# EAGLE schematic Leah board (EAGLE 7.1.0)
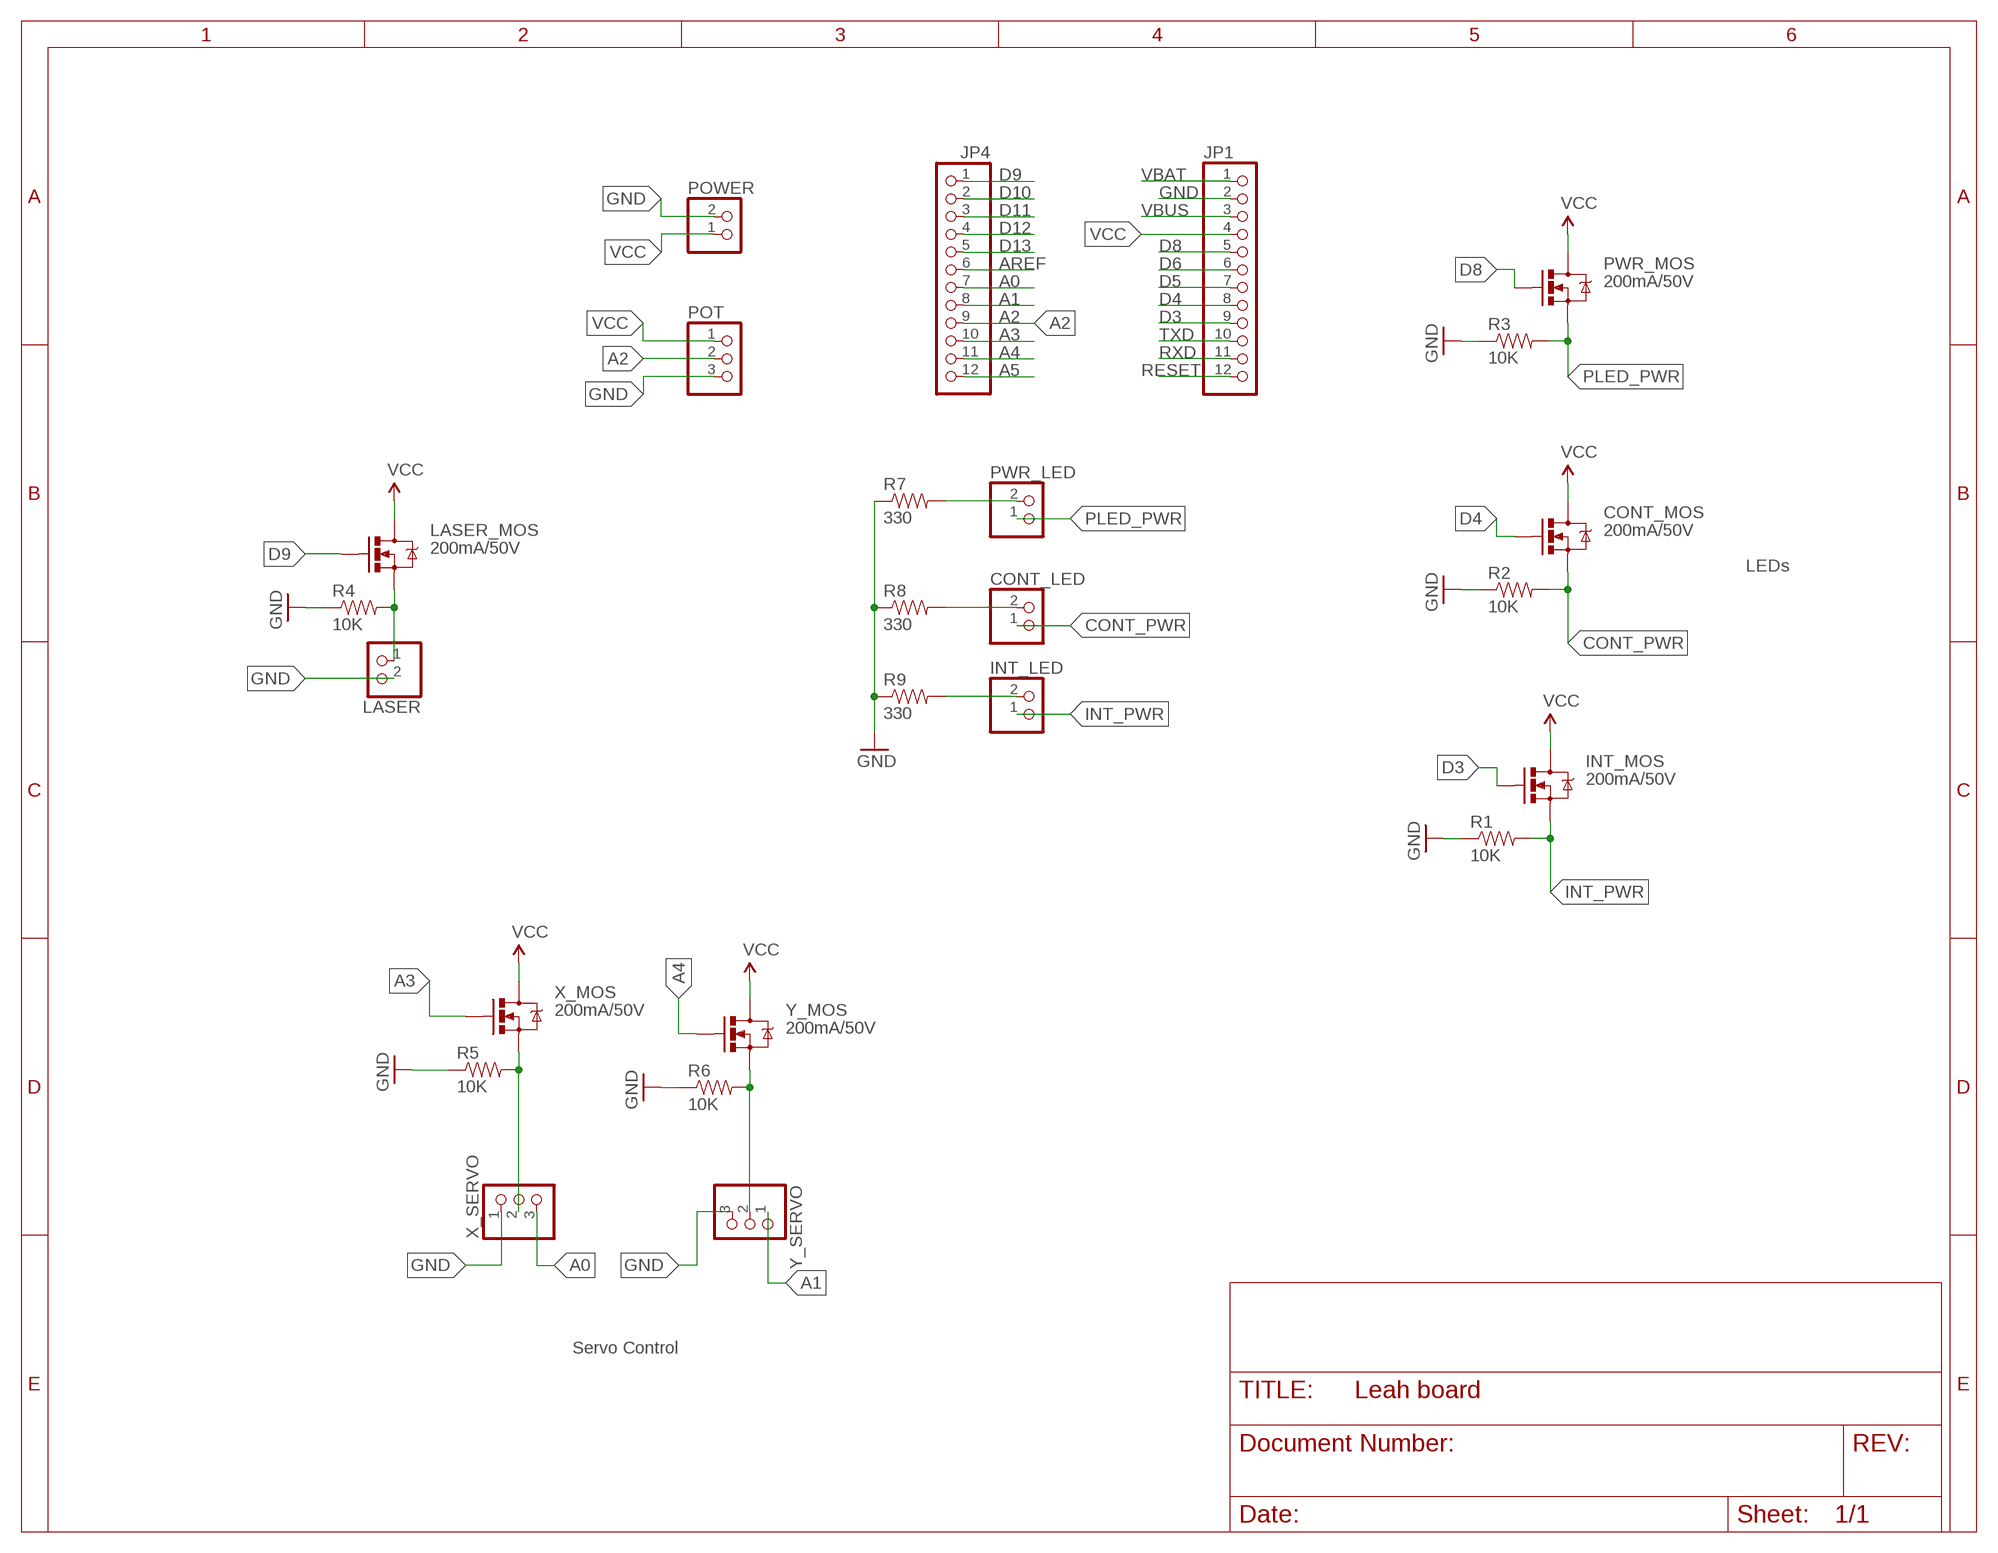
[diagram p0: schematic, sheet 1]

## Parts
CONT_LED  JST_2PIN-SMT-RA  [JST-PH-2-SMT-RA]
CONT_MOS  200mA/50V  MOSFET-NCHANNELBSS138  [SOT23-3]
INT_LED  JST_2PIN-SMT-RA  [JST-PH-2-SMT-RA]
INT_MOS  200mA/50V  MOSFET-NCHANNELBSS138  [SOT23-3]
JP1  PINHD-1X12-CB  [1X12-CB]
JP4  PINHD-1X12-CB  [1X12-CB]
LASER  JST_2PIN-SMT-RA  [JST-PH-2-SMT-RA]
LASER_MOS  200mA/50V  MOSFET-NCHANNELBSS138  [SOT23-3]
POT  JST_3PIN  [JSTPH3]
POWER  JST_2PIN-SMT-RA  [JST-PH-2-SMT-RA]
PWR_LED  JST_2PIN-SMT-RA  [JST-PH-2-SMT-RA]
PWR_MOS  200mA/50V  MOSFET-NCHANNELBSS138  [SOT23-3]
R1  10K  10KOHM-1/10W-1%(0603)0603  [0603-RES]
R2  10K  10KOHM-1/10W-1%(0603)0603  [0603-RES]
R3  10K  10KOHM-1/10W-1%(0603)0603  [0603-RES]
R4  10K  10KOHM-1/10W-1%(0603)0603  [0603-RES]
R5  10K  10KOHM-1/10W-1%(0603)0603  [0603-RES]
R6  10K  10KOHM-1/10W-1%(0603)0603  [0603-RES]
R7  330  3.3MOHM-1/10W-1%(0603)  [0603-RES]
R8  330  3.3MOHM-1/10W-1%(0603)  [0603-RES]
R9  330  3.3MOHM-1/10W-1%(0603)  [0603-RES]
X_MOS  200mA/50V  MOSFET-NCHANNELBSS138  [SOT23-3]
X_SERVO  PINHD-1X3  [1X03]
Y_MOS  200mA/50V  MOSFET-NCHANNELBSS138  [SOT23-3]
Y_SERVO  PINHD-1X3  [1X03]

## Nets
A0: JP4.7 X_SERVO.3
A1: JP4.8 Y_SERVO.1
A2: JP4.9 POT.2
A3: JP4.10 X_MOS.1(G)
A4: JP4.11 Y_MOS.1(G)
A5: JP4.12
AREF: JP4.6
CONT_PWR: CONT_LED.1 CONT_MOS.2(S) R2.2
D3: INT_MOS.1(G) JP1.9
D4: CONT_MOS.1(G) JP1.8
D5: JP1.7
D6: JP1.6
D8: JP1.5 PWR_MOS.1(G)
D9: JP4.1 LASER_MOS.1(G)
D10: JP4.2
D11: JP4.3
D12: JP4.4
D13: JP4.5
GND [power]: JP1.2 LASER.2 POT.3 POWER.2 R1.1 R2.1 R3.1 R4.1 R5.1 R6.1 R7.1 R8.1 R9.1 X_SERVO.1 Y_SERVO.3
INT_PWR: INT_LED.1 INT_MOS.2(S) R1.2
LASER_PWR: LASER.1 LASER_MOS.2(S) R4.2
N$6: R6.2 Y_MOS.2(S) Y_SERVO.2
N$7: R5.2 X_MOS.2(S) X_SERVO.2
N$8: PWR_LED.2 R7.2
N$9: CONT_LED.2 R8.2
N$10: INT_LED.2 R9.2
PLED_PWR: PWR_LED.1 PWR_MOS.2(S) R3.2
RESET: JP1.12
RXD: JP1.11
TXD: JP1.10
VBAT: JP1.1
VBUS [power]: JP1.3
VCC: CONT_MOS.3(D) INT_MOS.3(D) JP1.4 LASER_MOS.3(D) POT.1 POWER.1 PWR_MOS.3(D) X_MOS.3(D) Y_MOS.3(D)

## Notes on the sheet
- LEDs
- Servo Control

## Library data of the parts
CONT_LED INT_LED LASER POWER PWR_LED = adafruit:JST_2PIN: JST 2-Pin Connectors of various flavors SMT-RA (S2B-PH-SM4) 4UConnector #17311 SMT (B2B-PH-SM4) THM-RA (S2B-PH) THM (B2B-PH)
CONT_MOS INT_MOS LASER_MOS PWR_MOS X_MOS Y_MOS = SparkFun-DiscreteSemi:MOSFET-NCHANNEL: Common NMOSFET Parts MFG P/N Store ID Prod ID FDD8780 TRANS-09984 SI7820DN TRANS-11055 FDS6630A IC-08089 2N7002PW TRANS-11151 FQP30N06L COM-10213 TRANS-10060 BSS123LT1G TRANS-08345 BSS138 TRANS-00830 BS170 2N7000; PROD_ID: TRANS-00830
JP1 JP4 = adafruit:PINHD-1X12: PIN HEADER
POT = adafruit:JST_3PIN
R1-R6 = SparkFun-Resistors:10KOHM-1/10W-1%(0603): RES-00824; PROD_ID: RES-00824
R7-R9 = SparkFun-Resistors:3.3MOHM-1/10W-1%(0603): RES-11057; PROD_ID: RES-11057
X_SERVO Y_SERVO = adafruit:PINHD-1X3: PIN HEADER

## Net classes
1 power: width 0.305 mm